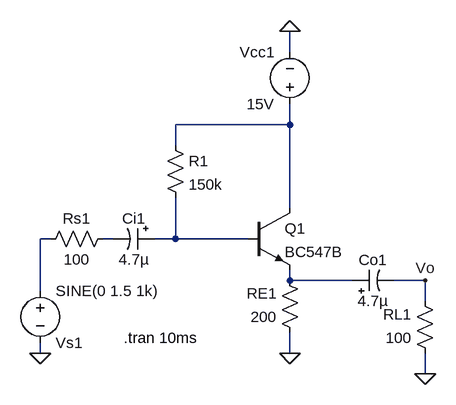
[diagram p0: schematic lab4.2e.asc]
lab4.2e.asc, the LTspice schematic file:
Version 4
SHEET 1 880 680
WIRE 96 -112 96 -144
WIRE 96 0 96 -32
WIRE 96 0 -80 0
WIRE -80 32 -80 0
WIRE 96 128 96 0
WIRE -272 176 -288 176
WIRE -176 176 -192 176
WIRE -80 176 -80 112
WIRE -80 176 -112 176
WIRE 32 176 -80 176
WIRE 96 240 96 224
WIRE 192 240 96 240
WIRE 304 240 256 240
WIRE -288 256 -288 176
WIRE 304 272 304 240
WIRE -288 352 -288 336
WIRE 96 352 96 320
WIRE 304 384 304 352
FLAG 96 352 0
FLAG 96 -144 0
FLAG -288 352 0
FLAG 304 384 0
FLAG 304 240 Vo
SYMBOL res 112 336 R180
WINDOW 0 36 76 Left 2
WINDOW 3 36 40 Left 2
SYMATTR InstName RE1
SYMATTR Value 200
SYMBOL npn 32 128 R0
SYMATTR InstName Q1
SYMATTR Value BC547B
SYMBOL voltage 96 -16 R180
WINDOW 0 24 96 Left 2
WINDOW 3 24 16 Left 2
WINDOW 123 0 0 Left 0
WINDOW 39 0 0 Left 0
SYMATTR InstName Vcc1
SYMATTR Value 15V
SYMBOL res -96 16 R0
SYMATTR InstName R1
SYMATTR Value 150k
SYMBOL res -176 160 R90
WINDOW 0 0 56 VBottom 2
WINDOW 3 32 56 VTop 2
SYMATTR InstName Rs1
SYMATTR Value 100
SYMBOL res 320 368 R180
WINDOW 0 36 76 Left 2
WINDOW 3 36 40 Left 2
SYMATTR InstName RL1
SYMATTR Value 100
SYMBOL polcap -112 160 R90
WINDOW 0 0 32 VBottom 2
WINDOW 3 32 32 VTop 2
SYMATTR InstName Ci1
SYMATTR Value 4.7µ
SYMATTR Description Capacitor
SYMATTR Type cap
SYMATTR SpiceLine V=50 Irms=30m Rser=4.7 Lser=0 mfg="Nichicon" pn="UPR1H4R7MAH" type="Al electrolytic"
SYMBOL voltage -288 240 R0
WINDOW 0 24 96 Left 2
WINDOW 3 24 16 Left 2
WINDOW 123 0 0 Left 0
WINDOW 39 0 0 Left 0
SYMATTR InstName Vs1
SYMATTR Value SINE(0 1.5 1k)
SYMBOL polcap 192 256 R270
WINDOW 0 32 32 VTop 2
WINDOW 3 0 32 VBottom 2
SYMATTR InstName Co1
SYMATTR Value 4.7µ
SYMATTR Description Capacitor
SYMATTR Type cap
SYMATTR SpiceLine V=50 Irms=30m Rser=4.7 Lser=0 mfg="Nichicon" pn="UPR1H4R7MAH" type="Al electrolytic"
TEXT -160 328 Left 2 !.tran 10ms

The netlist it stands for:
* lab4.2e.asc
RE1 0 N005 200
Q1 N001 N004 N005 0 BC547B
Vcc1 N001 0 15V
R1 N001 N004 150k
Rs1 N003 N002 100
RL1 0 Vo 100
Ci1 N004 N003 4.7µ V=50 Irms=30m Rser=4.7 Lser=0 mfg="Nichicon" pn="UPR1H4R7MAH" type="Al electrolytic"
Vs1 N002 0 SINE(0 1.5 1k)
Co1 N005 Vo 4.7µ V=50 Irms=30m Rser=4.7 Lser=0 mfg="Nichicon" pn="UPR1H4R7MAH" type="Al electrolytic"
.model NPN NPN
.model PNP PNP
.lib standard.bjt
.tran 10ms
.backanno
.end